# Altium schematic sheet PCI_ASTROPIX_carrier.SchDoc
size A2
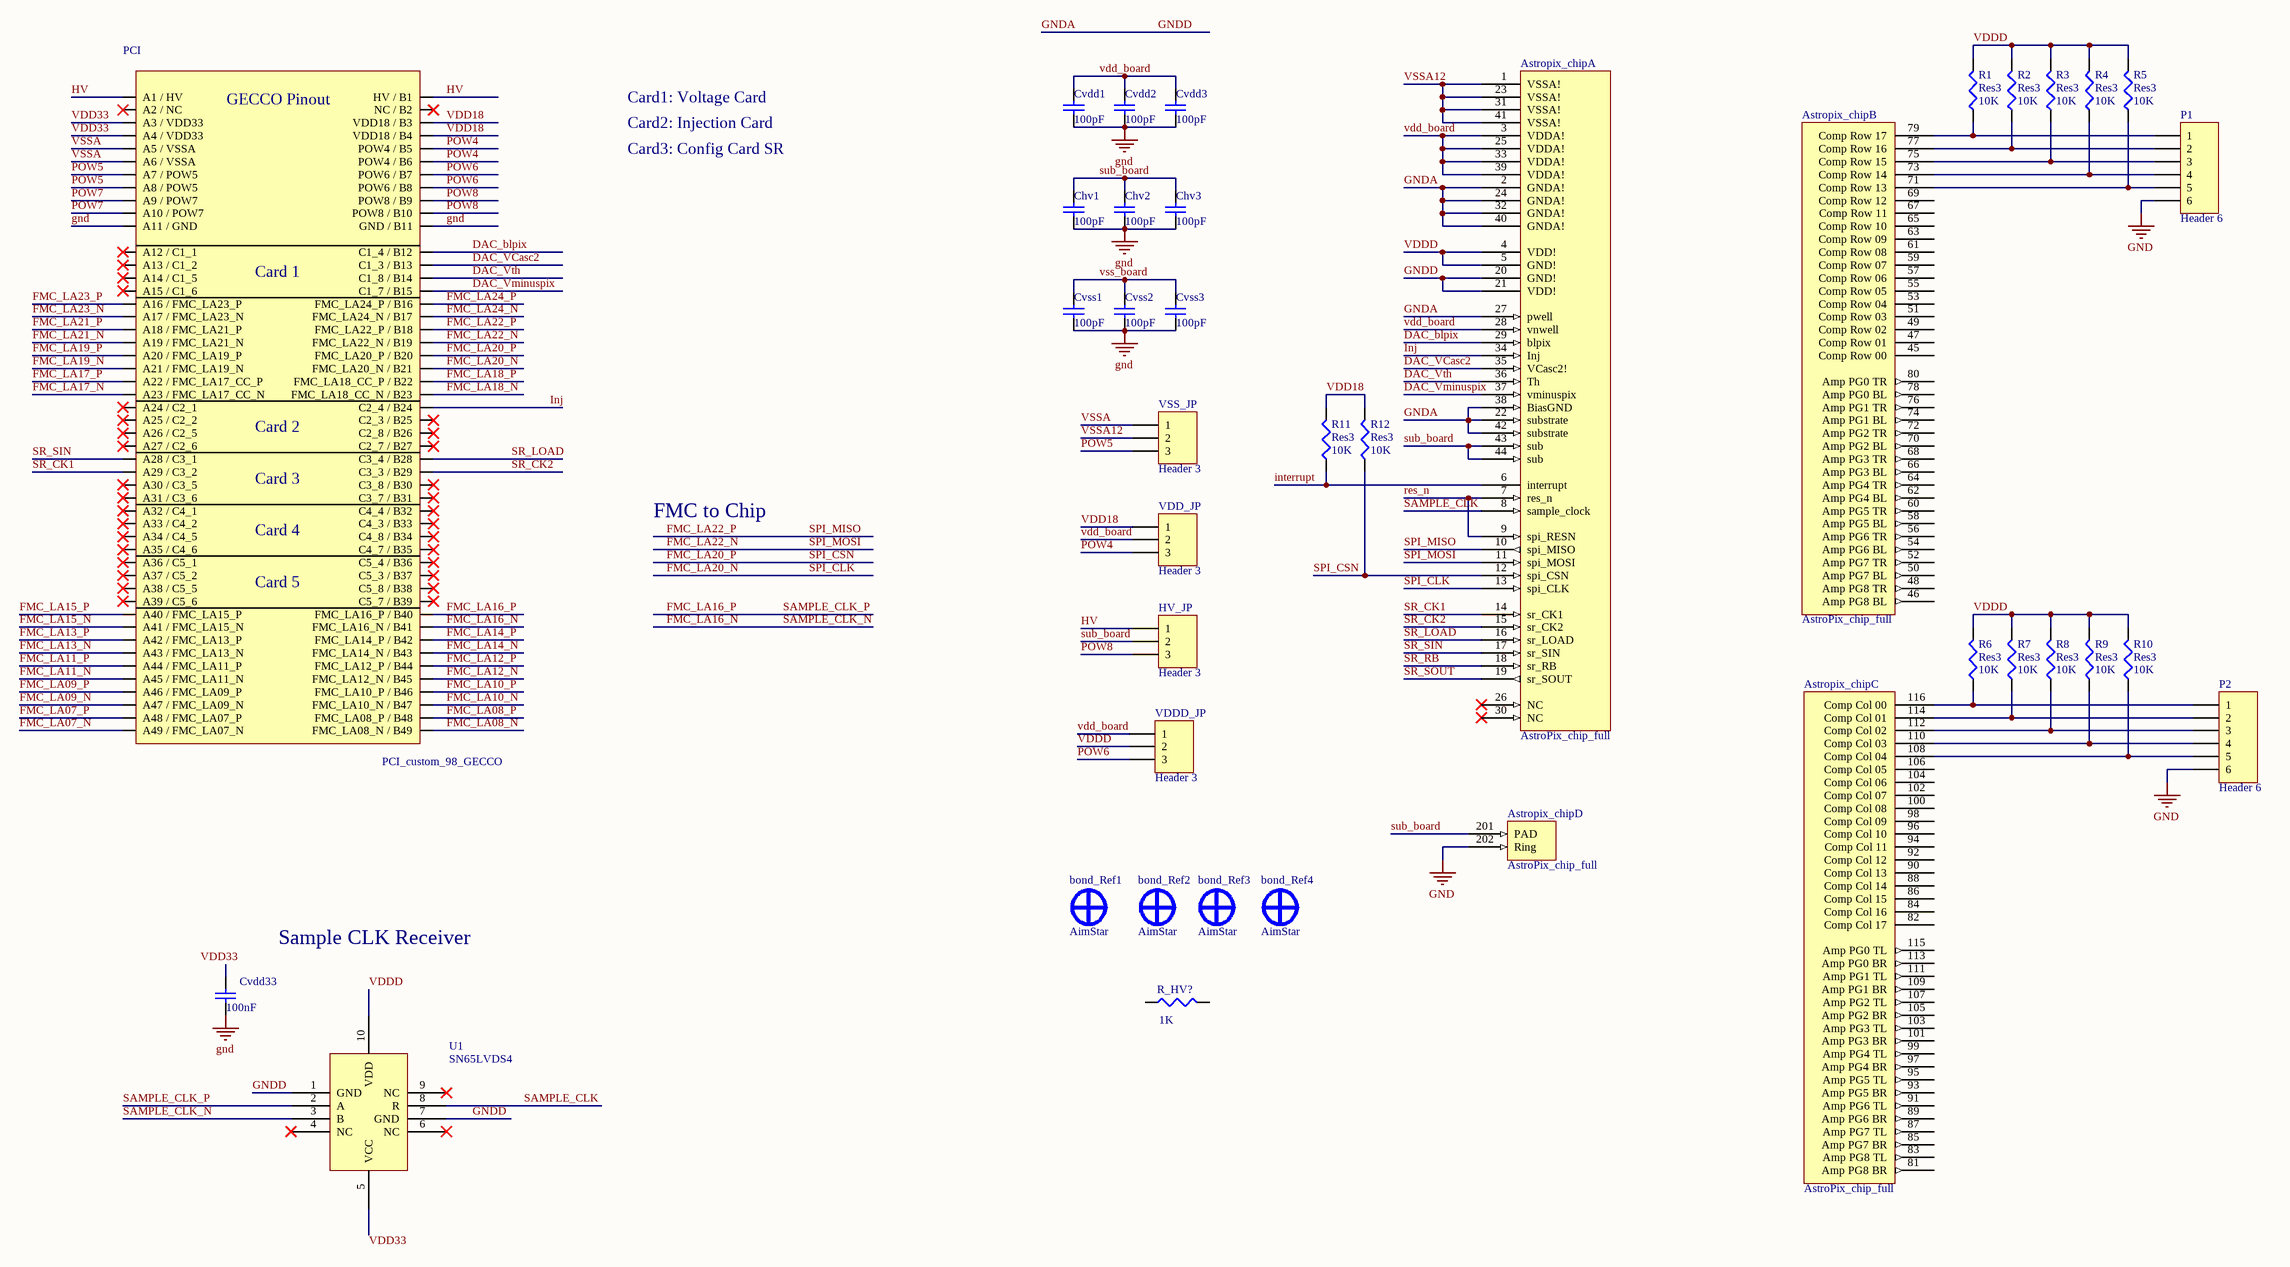
[diagram p0: PCI_ASTROPIX_carrier.SchDoc]

## Parts
Astropix_chip  AstroPix_chip_full  [Astropix_Chip_w_bondpads_1mm_distance_125u - duplicate - duplicate]  (parts A,B,C,D of 4)
bond_Ref1  AimStar  [AimStar_PCB]
bond_Ref2  AimStar  [AimStar_PCB]
bond_Ref3  AimStar  [AimStar_PCB]
bond_Ref4  AimStar  [AimStar_PCB]
Chv1  value 100pF  [1608[0603]]  (hidden comment: Cap Semi)
Chv2  value 100pF  [1608[0603]]  (hidden comment: Cap Semi)
Chv3  value 100pF  [C1210]  (hidden comment: Cap Semi)
Cvdd1  value 100pF  [1608[0603]]  (hidden comment: Cap Semi)
Cvdd2  value 100pF  [1608[0603]]  (hidden comment: Cap Semi)
Cvdd3  value 100pF  [C1210]  (hidden comment: Cap Semi)
Cvdd33  value 100nF  [1608[0603]]  (hidden comment: Cap Semi)
Cvss1  value 100pF  [1608[0603]]  (hidden comment: Cap Semi)
Cvss2  value 100pF  [1608[0603]]  (hidden comment: Cap Semi)
Cvss3  value 100pF  [C1210]  (hidden comment: Cap Semi)
HV_JP  Header 3  [HDR1X3]
P1  Header 6  [HDR1X6]
P2  Header 6  [HDR1X6]
PCI  PCI_custom_98_GECCO  [PCI_for_PCB_98]
R1  Res3  value 10K  [J1-0603]
R2  Res3  value 10K  [J1-0603]
R3  Res3  value 10K  [J1-0603]
R4  Res3  value 10K  [J1-0603]
R5  Res3  value 10K  [J1-0603]
R6  Res3  value 10K  [J1-0603]
R7  Res3  value 10K  [J1-0603]
R8  Res3  value 10K  [J1-0603]
R9  Res3  value 10K  [J1-0603]
R10  Res3  value 10K  [J1-0603]
R11  Res3  value 10K  [J1-0603]
R12  Res3  value 10K  [J1-0603]
R_HV?  value 1K  [14-1210]  (hidden comment: Res3)
U1  SN65LVDS4  [SN65LVDS4RSER]
VDD_JP  Header 3  [HDR1X3]
VDDD_JP  Header 3  [HDR1X3]
VSS_JP  Header 3  [HDR1X3]

## Nets
gnd: Astropix_chip.202(Ring) Chv1.1 Chv2.1 Chv3.1 Cvdd1.1 Cvdd2.1 Cvdd3.1 Cvdd33.1 Cvss1.1 Cvss2.1 Cvss3.1 P1.6 P2.6 PCI.A11(A11_/_GND) PCI.B11(GND_/_B11)
DAC_blpix: Astropix_chip.29(blpix) PCI.B12(C1_4_/_B12)
DAC_VCasc2: Astropix_chip.35(VCasc2!) PCI.B13(C1_3_/_B13)
DAC_Vminuspix: Astropix_chip.37(vminuspix) PCI.B15(C1_7_/_B15)
DAC_Vth: Astropix_chip.36(Th) PCI.B14(C1_8_/_B14)
FMC_LA07_N: PCI.A49(A49_/_FMC_LA07_N)
FMC_LA07_P: PCI.A48(A48_/_FMC_LA07_P)
FMC_LA08_N: PCI.B49(FMC_LA08_N_/_B49)
FMC_LA08_P: PCI.B48(FMC_LA08_P_/_B48)
FMC_LA09_N: PCI.A47(A47_/_FMC_LA09_N)
FMC_LA09_P: PCI.A46(A46_/_FMC_LA09_P)
FMC_LA10_N: PCI.B47(FMC_LA10_N_/_B47)
FMC_LA10_P: PCI.B46(FMC_LA10_P_/_B46)
FMC_LA11_N: PCI.A45(A45_/_FMC_LA11_N)
FMC_LA11_P: PCI.A44(A44_/_FMC_LA11_P)
FMC_LA12_N: PCI.B45(FMC_LA12_N_/_B45)
FMC_LA12_P: PCI.B44(FMC_LA12_P_/_B44)
FMC_LA13_N: PCI.A43(A43_/_FMC_LA13_N)
FMC_LA13_P: PCI.A42(A42_/_FMC_LA13_P)
FMC_LA14_N: PCI.B43(FMC_LA14_N_/_B43)
FMC_LA14_P: PCI.B42(FMC_LA14_P_/_B42)
FMC_LA15_N: PCI.A41(A41_/_FMC_LA15_N)
FMC_LA15_P: PCI.A40(A40_/_FMC_LA15_P)
FMC_LA16_N: PCI.B41(FMC_LA16_N_/_B41) U1.3(B)  [also labelled SAMPLE_CLK_N]
FMC_LA16_P: PCI.B40(FMC_LA16_P_/_B40) U1.2(A)  [also labelled SAMPLE_CLK_P]
FMC_LA17_N: PCI.A23(A23_/_FMC_LA17_CC_N)
FMC_LA17_P: PCI.A22(A22_/_FMC_LA17_CC_P)
FMC_LA18_N: PCI.B23(FMC_LA18_CC_N_/_B23)
FMC_LA18_P: PCI.B22(FMC_LA18_CC_P_/_B22)
FMC_LA19_N: PCI.A21(A21_/_FMC_LA19_N)
FMC_LA19_P: PCI.A20(A20_/_FMC_LA19_P)
FMC_LA20_N: Astropix_chip.13(spi_CLK) PCI.B21(FMC_LA20_N_/_B21)  [also labelled SPI_CLK]
FMC_LA20_P: Astropix_chip.12(spi_CSN) PCI.B20(FMC_LA20_P_/_B20) R12.1  [also labelled SPI_CSN]
FMC_LA21_N: PCI.A19(A19_/_FMC_LA21_N)
FMC_LA21_P: PCI.A18(A18_/_FMC_LA21_P)
FMC_LA22_N: Astropix_chip.11(spi_MOSI) PCI.B19(FMC_LA22_N_/_B19)  [also labelled SPI_MOSI]
FMC_LA22_P: Astropix_chip.10(spi_MISO) PCI.B18(FMC_LA22_P_/_B18)  [also labelled SPI_MISO]
FMC_LA23_N: PCI.A17(A17_/_FMC_LA23_N)
FMC_LA23_P: PCI.A16(A16_/_FMC_LA23_P)
FMC_LA24_N: PCI.B17(FMC_LA24_N_/_B17)
FMC_LA24_P: PCI.B16(FMC_LA24_P_/_B16)
GNDA: Astropix_chip.2(GNDA!) Astropix_chip.20(GND!) Astropix_chip.21(VDD!) Astropix_chip.22(substrate) Astropix_chip.24(GNDA!) Astropix_chip.27(pwell) Astropix_chip.32(GNDA!) Astropix_chip.38(BiasGND) Astropix_chip.40(GNDA!) Astropix_chip.42(substrate) U1.1(GND) U1.7(GND)  [also labelled GNDD]
HV: HV_JP.1 PCI.A1(A1_/_HV) PCI.B1(HV_/_B1)
Inj: Astropix_chip.34(Inj) PCI.B24(C2_4_/_B24)
interrupt: Astropix_chip.6(interrupt) R11.1
POW4: PCI.B5(POW4_/_B5) PCI.B6(POW4_/_B6) VDD_JP.3
POW5: PCI.A7(A7_/_POW5) PCI.A8(A8_/_POW5) VSS_JP.3
POW6: PCI.B7(POW6_/_B7) PCI.B8(POW6_/_B8) VDDD_JP.3
POW7: PCI.A9(A9_/_POW7) PCI.A10(A10_/_POW7)
POW8: HV_JP.3 PCI.B9(POW8_/_B9) PCI.B10(POW8_/_B10)
res_n: Astropix_chip.7(res_n) Astropix_chip.9(spi_RESN)
SAMPLE_CLK: Astropix_chip.8(sample_clock) U1.8(R)
SR_CK1: Astropix_chip.14(sr_CK1) PCI.A29(A29_/_C3_2)
SR_CK2: Astropix_chip.15(sr_CK2) PCI.B29(C3_3_/_B29)
SR_LOAD: Astropix_chip.16(sr_LOAD) PCI.B28(C3_4_/_B28)
SR_RB: Astropix_chip.18(sr_RB)
SR_SIN: Astropix_chip.17(sr_SIN) PCI.A28(A28_/_C3_1)
SR_SOUT: Astropix_chip.19(sr_SOUT)
sub_board: Astropix_chip.43(sub) Astropix_chip.44(sub) Astropix_chip.201(PAD) Chv1.2 Chv2.2 Chv3.2 HV_JP.2
VDD18: PCI.B3(VDD18_/_B3) PCI.B4(VDD18_/_B4) R11.2 R12.2 VDD_JP.1
VDD33: PCI.A3(A3_/_VDD33) PCI.A4(A4_/_VDD33)
vdd_board: Astropix_chip.3(VDDA!) Astropix_chip.25(VDDA!) Astropix_chip.28(vnwell) Astropix_chip.33(VDDA!) Astropix_chip.39(VDDA!) Cvdd1.2 Cvdd2.2 Cvdd3.2 VDD_JP.2 VDDD_JP.1
VDDD: Astropix_chip.4(VDD!) Astropix_chip.5(GND!) R1.2 R2.2 R3.2 R4.2 R5.2 R6.2 R7.2 R8.2 R9.2 R10.2 U1.10(VDD) VDDD_JP.2
vss_board: Cvss1.2 Cvss2.2 Cvss3.2
VSSA: PCI.A5(A5_/_VSSA) PCI.A6(A6_/_VSSA) VSS_JP.1
VSSA12: Astropix_chip.1(VSSA!) Astropix_chip.23(VSSA!) Astropix_chip.31(VSSA!) Astropix_chip.41(VSSA!) VSS_JP.2
NetAstropix_chip_71: Astropix_chip.71(Comp_Row_13) P1.5 R5.1
NetAstropix_chip_73: Astropix_chip.73(Comp_Row_14) P1.4 R4.1
NetAstropix_chip_75: Astropix_chip.75(Comp_Row_15) P1.3 R3.1
NetAstropix_chip_77: Astropix_chip.77(Comp_Row_16) P1.2 R2.1
NetAstropix_chip_79: Astropix_chip.79(Comp_Row_17) P1.1 R1.1
NetAstropix_chip_108: Astropix_chip.108(Comp_Col_04) P2.5 R10.1
NetAstropix_chip_110: Astropix_chip.110(Comp_Col_03) P2.4 R9.1
NetAstropix_chip_112: Astropix_chip.112(Comp_Col_02) P2.3 R8.1
NetAstropix_chip_114: Astropix_chip.114(Comp_Col_01) P2.2 R7.1
NetAstropix_chip_116: Astropix_chip.116(Comp_Col_00) P2.1 R6.1

Not connected (* = marked no-connect by the designer): Astropix_chip 26(NC)* 30(NC)* 45(Comp_Row_00) 46(Amp_PG8_BL) 47(Comp_Row_01) 48(Amp_PG8_TR) 49(Comp_Row_02) 50(Amp_PG7_BL) 51(Comp_Row_03) 52(Amp_PG7_TR) 53(Comp_Row_04) 54(Amp_PG6_BL) 55(Comp_Row_05) 56(Amp_PG6_TR) 57(Comp_Row_06) 58(Amp_PG5_BL) 59(Comp_Row_07) 60(Amp_PG5_TR) 61(Comp_Row_08) 62(Amp_PG4_BL) 63(Comp_Row_09) 64(Amp_PG4_TR) 65(Comp_Row_10) 66(Amp_PG3_BL) 67(Comp_Row_11) 68(Amp_PG3_TR) 69(Comp_Row_12) 70(Amp_PG2_BL) 72(Amp_PG2_TR) 74(Amp_PG1_BL) 76(Amp_PG1_TR) 78(Amp_PG0_BL) 80(Amp_PG0_TR) 81(Amp_PG8_BR) 82(Comp_Col_17) 83(Amp_PG8_TL) 84(Comp_Col_16) 85(Amp_PG7_BR) 86(Comp_Col_15) 87(Amp_PG7_TL) 88(Comp_Col_14) 89(Amp_PG6_BR) 90(Comp_Col_13) 91(Amp_PG6_TL) 92(Comp_Col_12) 93(Amp_PG5_BR) 94(Comp_Col_11) 95(Amp_PG5_TL) 96(Comp_Col_10) 97(Amp_PG4_BR) 98(Comp_Col_09) 99(Amp_PG4_TL) 100(Comp_Col_08) 101(Amp_PG3_BR) 102(Comp_Col_07) 103(Amp_PG3_TL) 104(Comp_Col_06) 105(Amp_PG2_BR) 106(Comp_Col_05) 107(Amp_PG2_TL) 109(Amp_PG1_BR) 111(Amp_PG1_TL) 113(Amp_PG0_BR) 115(Amp_PG0_TL); Cvdd33 2; PCI A2(A2_/_NC)* A12(A12_/_C1_1)* A13(A13_/_C1_2)* A14(A14_/_C1_5)* A15(A15_/_C1_6)* A24(A24_/_C2_1)* A25(A25_/_C2_2)* A26(A26_/_C2_5)* A27(A27_/_C2_6)* A30(A30_/_C3_5)* A31(A31_/_C3_6)* A32(A32_/_C4_1)* A33(A33_/_C4_2)* A34(A34_/_C4_5)* A35(A35_/_C4_6)* A36(A36_/_C5_1)* A37(A37_/_C5_2)* A38(A38_/_C5_5)* A39(A39_/_C5_6)* B2(NC_/_B2)* B25(C2_3_/_B25)* B26(C2_8_/_B26)* B27(C2_7_/_B27)* B30(C3_8_/_B30)* B31(C3_7_/_B31)* B32(C4_4_/_B32)* B33(C4_3_/_B33)* B34(C4_8_/_B34)* B35(C4_7_/_B35)* B36(C5_4_/_B36)* B37(C5_3_/_B37)* B38(C5_8_/_B38)* B39(C5_7_/_B39)*; R_HV? 1 2; U1 4(NC)* 5(VCC) 6(NC)* 9(NC)*

## Notes on the sheet
- Card1: Voltage Card
- Card2: Injection Card
- Card3: Config Card SR
- FMC to Chip
- Sample CLK Receiver
- Labels drawn without touching a wire or pin: VDD33
- (in symbol PCI_custom_98_GECCO) GECCO Pinout; Card 1; Card 2; Card 3; Card 4; Card 5

## Library data of the parts
Chv1-Chv3 Cvdd1-Cvdd3 Cvdd33 Cvss1-Cvss3 = Cap Semi: Capacitor (Semiconductor SIM Model); Published: 8-Jun-2000; LatestRevisionDate: 29-May-2009; LatestRevisionNote: IPC-7351 Footprint Added.; PackageReference: C1206; Publisher: Altium Limited; PackageDescription: Chip Capacitor
HV_JP VDD_JP VDDD_JP VSS_JP = Header 3: Header, 3-Pin; LatestRevisionDate: 17-Jul-2002; LatestRevisionNote: Re-released for DXP Platform.; Publisher: Altium Limited
P1 P2 = Header 6: Header, 6-Pin; LatestRevisionDate: 17-Jul-2002; LatestRevisionNote: Re-released for DXP Platform.; Publisher: Altium Limited
R1-R12 R_HV? = Res3: Resistor; Published: 8-Jun-2000; LatestRevisionDate: 29-May-2009; LatestRevisionNote: IPC-7351 Footprint Added.; PackageReference: J1-0603; Publisher: Altium Limited; PackageDescription: Chip Resistor
U1 = SN65LVDS4: 1.8-V High-Speed  Differential  Line Receiver